# EAGLE design max232 (EAGLE 6.4)
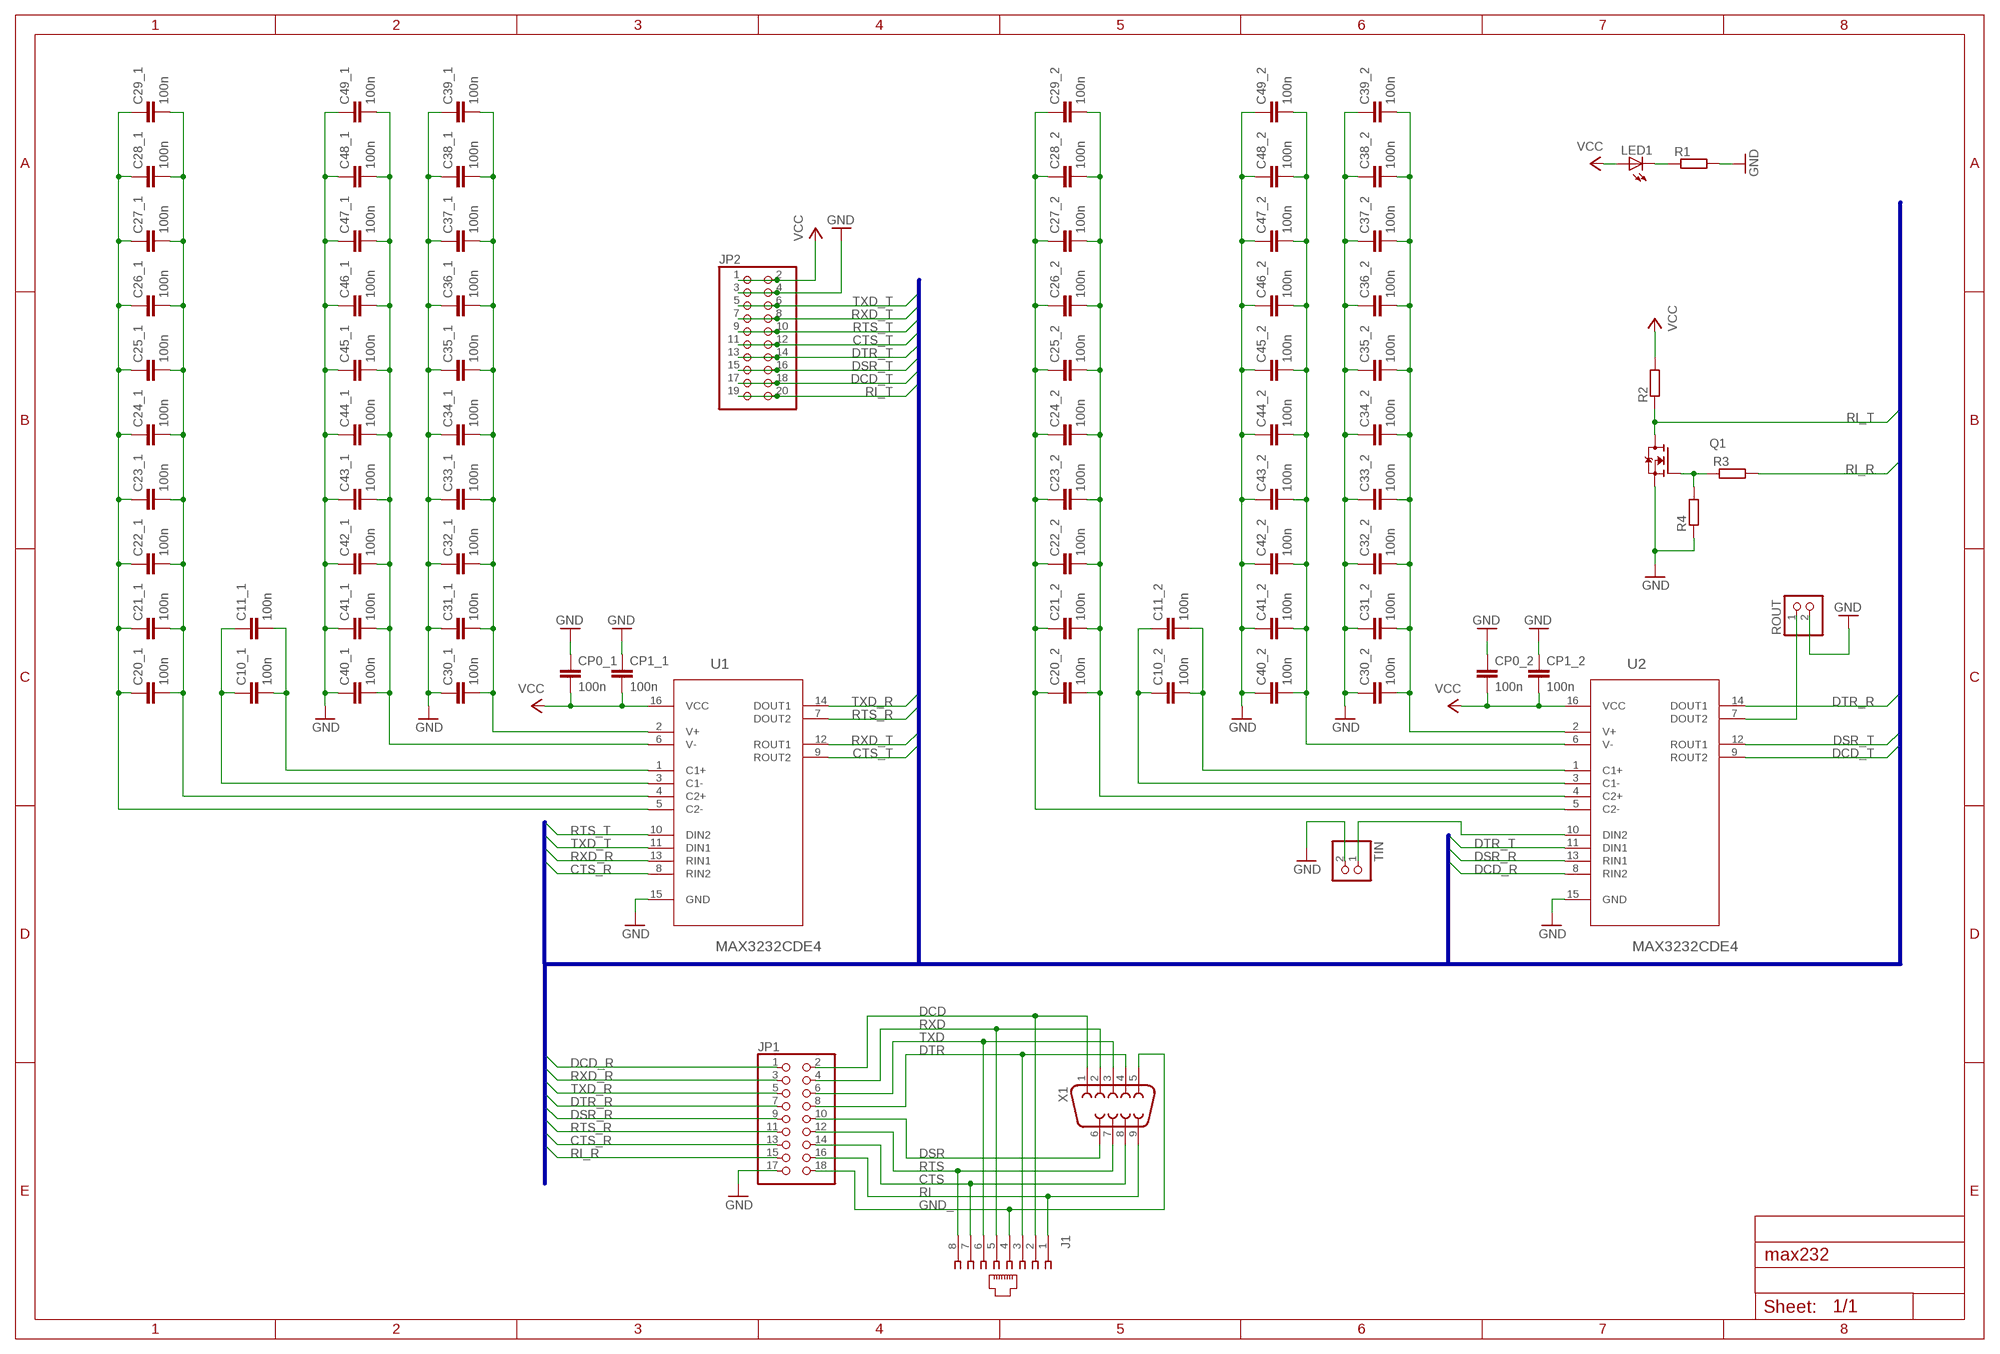
[diagram p0: schematic, sheet 1]

## Parts
C10_1  100n  C-EUC0402  [C0402]
C10_2  100n  C-EUC0402  [C0402]
C11_1  100n  C-EUC0402  [C0402]
C11_2  100n  C-EUC0402  [C0402]
C20_1  100n  C-EUC0402  [C0402]
C20_2  100n  C-EUC0402  [C0402]
C21_1  100n  C-EUC0402  [C0402]
C21_2  100n  C-EUC0402  [C0402]
C22_1  100n  C-EUC0402  [C0402]
C22_2  100n  C-EUC0402  [C0402]
C23_1  100n  C-EUC0402  [C0402]
C23_2  100n  C-EUC0402  [C0402]
C24_1  100n  C-EUC0402  [C0402]
C24_2  100n  C-EUC0402  [C0402]
C25_1  100n  C-EUC0402  [C0402]
C25_2  100n  C-EUC0402  [C0402]
C26_1  100n  C-EUC0402  [C0402]
C26_2  100n  C-EUC0402  [C0402]
C27_1  100n  C-EUC0402  [C0402]
C27_2  100n  C-EUC0402  [C0402]
C28_1  100n  C-EUC0402  [C0402]
C28_2  100n  C-EUC0402  [C0402]
C29_1  100n  C-EUC0402  [C0402]
C29_2  100n  C-EUC0402  [C0402]
C30_1  100n  C-EUC0402  [C0402]
C30_2  100n  C-EUC0402  [C0402]
C31_1  100n  C-EUC0402  [C0402]
C31_2  100n  C-EUC0402  [C0402]
C32_1  100n  C-EUC0402  [C0402]
C32_2  100n  C-EUC0402  [C0402]
C33_1  100n  C-EUC0402  [C0402]
C33_2  100n  C-EUC0402  [C0402]
C34_1  100n  C-EUC0402  [C0402]
C34_2  100n  C-EUC0402  [C0402]
C35_1  100n  C-EUC0402  [C0402]
C35_2  100n  C-EUC0402  [C0402]
C36_1  100n  C-EUC0402  [C0402]
C36_2  100n  C-EUC0402  [C0402]
C37_1  100n  C-EUC0402  [C0402]
C37_2  100n  C-EUC0402  [C0402]
C38_1  100n  C-EUC0402  [C0402]
C38_2  100n  C-EUC0402  [C0402]
C39_1  100n  C-EUC0402  [C0402]
C39_2  100n  C-EUC0402  [C0402]
C40_1  100n  C-EUC0402  [C0402]
C40_2  100n  C-EUC0402  [C0402]
C41_1  100n  C-EUC0402  [C0402]
C41_2  100n  C-EUC0402  [C0402]
C42_1  100n  C-EUC0402  [C0402]
C42_2  100n  C-EUC0402  [C0402]
C43_1  100n  C-EUC0402  [C0402]
C43_2  100n  C-EUC0402  [C0402]
C44_1  100n  C-EUC0402  [C0402]
C44_2  100n  C-EUC0402  [C0402]
C45_1  100n  C-EUC0402  [C0402]
C45_2  100n  C-EUC0402  [C0402]
C46_1  100n  C-EUC0402  [C0402]
C46_2  100n  C-EUC0402  [C0402]
C47_1  100n  C-EUC0402  [C0402]
C47_2  100n  C-EUC0402  [C0402]
C48_1  100n  C-EUC0402  [C0402]
C48_2  100n  C-EUC0402  [C0402]
C49_1  100n  C-EUC0402  [C0402]
C49_2  100n  C-EUC0402  [C0402]
CP0_1  100n  C-EUC0402  [C0402]
CP0_2  100n  C-EUC0402  [C0402]
CP1_1  100n  C-EUC0402  [C0402]
CP1_2  100n  C-EUC0402  [C0402]
J1  215877-4  [215877-4]
JP1  PINHD-2X9  [2X09]
JP2  PINHD-2X10/90  [2X10/90]
LED1  LEDCHIP-LED0603  [CHIP-LED0603]
Q1  N-MOSFET-SOT23-GSD  [SOT23]
R1  R-EU_R0603  [R0603]
R2  R-EU_R0603  [R0603]
R3  R-EU_R0603  [R0603]
R4  R-EU_R0603  [R0603]
ROUT  PINHD-1X2  [1X02]
TIN  PINHD-1X2  [1X02]
U1  MAX3232CDE4  [SOIC127P600X175-16N]
U2  MAX3232CDE4  [SOIC127P600X175-16N]
X1  F09HP  [F09HP]

## Nets
C1+1: C10_1.2 C11_1.2 U1.1(C1+)
C1+2: C10_2.2 C11_2.2 U2.1(C1+)
C1-1: C10_1.1 C11_1.1 U1.3(C1-)
C1-2: C10_2.1 C11_2.1 U2.3(C1-)
C2+1: C20_1.2 C21_1.2 C22_1.2 C23_1.2 C24_1.2 C25_1.2 C26_1.2 C27_1.2 C28_1.2 C29_1.2 U1.4(C2+)
C2+2: C20_2.2 C21_2.2 C22_2.2 C23_2.2 C24_2.2 C25_2.2 C26_2.2 C27_2.2 C28_2.2 C29_2.2 U2.4(C2+)
C2-1: C20_1.1 C21_1.1 C22_1.1 C23_1.1 C24_1.1 C25_1.1 C26_1.1 C27_1.1 C28_1.1 C29_1.1 U1.5(C2-)
C2-2: C20_2.1 C21_2.1 C22_2.1 C23_2.1 C24_2.1 C25_2.1 C26_2.1 C27_2.1 C28_2.1 C29_2.1 U2.5(C2-)
CTS: J1.7 JP1.14 X1.8
CTS_R: JP1.13 U1.8(RIN2)
CTS_T: JP2.11 JP2.12 U1.9(ROUT2)
DCD: J1.2 JP1.2 X1.1
DCD_R: JP1.1 U2.8(RIN2)
DCD_T: JP2.17 JP2.18 U2.9(ROUT2)
DSR: JP1.10 X1.6
DSR_R: JP1.9 U2.13(RIN1)
DSR_T: JP2.15 JP2.16 U2.12(ROUT1)
DTR: J1.3 JP1.8 X1.4
DTR_R: JP1.7 U2.14(DOUT1)
DTR_T: JP2.13 JP2.14 U2.11(DIN1)
GND: C30_1.1 C30_2.1 C31_1.1 C31_2.1 C32_1.1 C32_2.1 C33_1.1 C33_2.1 C34_1.1 C34_2.1 C35_1.1 C35_2.1 C36_1.1 C36_2.1 C37_1.1 C37_2.1 C38_1.1 C38_2.1 C39_1.1 C39_2.1 C40_1.1 C40_2.1 C41_1.1 C41_2.1 C42_1.1 C42_2.1 C43_1.1 C43_2.1 C44_1.1 C44_2.1 C45_1.1 C45_2.1 C46_1.1 C46_2.1 C47_1.1 C47_2.1 C48_1.1 C48_2.1 C49_1.1 C49_2.1 CP0_1.1 CP0_2.1 CP1_1.1 CP1_2.1 JP1.17 JP2.3 JP2.4 Q1.2(S) R1.2 R4.1 ROUT.2 TIN.2 U1.15(GND) U2.15(GND)
GND_: J1.4 JP1.18 X1.5
PWR_LED: LED1.C R1.1
RI: J1.1 JP1.16 X1.9
RI_G: Q1.1(G) R3.1 R4.2
RI_R: JP1.15 R3.2
RI_T: JP2.19 JP2.20 Q1.3(D) R2.1
ROUT: ROUT.1 U2.7(DOUT2)
RTS: J1.8 JP1.12 X1.7
RTS_R: JP1.11 U1.7(DOUT2)
RTS_T: JP2.9 JP2.10 U1.10(DIN2)
RXD: J1.5 JP1.4 X1.2
RXD_R: JP1.3 U1.13(RIN1)
RXD_T: JP2.7 JP2.8 U1.12(ROUT1)
TIN: TIN.1 U2.10(DIN2)
TXD: J1.6 JP1.6 X1.3
TXD_R: JP1.5 U1.14(DOUT1)
TXD_T: JP2.5 JP2.6 U1.11(DIN1)
V+1: C30_1.2 C31_1.2 C32_1.2 C33_1.2 C34_1.2 C35_1.2 C36_1.2 C37_1.2 C38_1.2 C39_1.2 U1.2(V+)
V+2: C30_2.2 C31_2.2 C32_2.2 C33_2.2 C34_2.2 C35_2.2 C36_2.2 C37_2.2 C38_2.2 C39_2.2 U2.2(V+)
V-1: C40_1.2 C41_1.2 C42_1.2 C43_1.2 C44_1.2 C45_1.2 C46_1.2 C47_1.2 C48_1.2 C49_1.2 U1.6(V-)
V-2: C40_2.2 C41_2.2 C42_2.2 C43_2.2 C44_2.2 C45_2.2 C46_2.2 C47_2.2 C48_2.2 C49_2.2 U2.6(V-)
VCC: CP0_1.2 CP0_2.2 CP1_1.2 CP1_2.2 JP2.1 JP2.2 LED1.A R2.2 U1.16(VCC) U2.16(VCC)

## Buses
DCD_T,DCD_R,RXD_T,RXD_R,TXD_T,TXD_R,DTR_T,DTR_R,DSR_T,DSR_R,RTS_T,RTS_R,CTS_T,CTS_R,RI_T,RI_R

## Library data of the parts
C10_1 C10_2 C11_1 C11_2 C20_1 C20_2 C21_1 C21_2 C22_1 C22_2 C23_1 C23_2 C24_1 C24_2 C25_1 C25_2 C26_1 C26_2 C27_1 C27_2 C28_1 C28_2 C29_1 C29_2 C30_1 C30_2 C31_1 C31_2 C32_1 C32_2 C33_1 C33_2 C34_1 C34_2 C35_1 C35_2 C36_1 C36_2 C37_1 C37_2 C38_1 C38_2 C39_1 C39_2 C40_1 C40_2 C41_1 C41_2 C42_1 C42_2 C43_1 C43_2 C44_1 C44_2 C45_1 C45_2 C46_1 C46_2 C47_1 C47_2 C48_1 C48_2 C49_1 C49_2 CP0_1 CP0_2 CP1_1 CP1_2 = rcl_upravena:C-EU: CAPACITOR, European symbol
J1 = con-amp:215877-4: AMP connector
JP1 = pinhead:PINHD-2X9: PIN HEADER
JP2 = pinhead:PINHD-2X10: PIN HEADER
LED1 = led:LED: LED OSRAM: - CHIPLED LG R971, LG N971, LY N971, LG Q971, LY Q971, LO R971, LY R971 LH N974, LH R974 LS Q976, LO Q976, LY Q976 LO Q996 - Hyper CHIPLED LW Q18S LB Q993, LB Q99A, LB R99A - SideLED LS A670, LO A670, LY A670, LG A670, LP A670 LB A673, LV A673, LT A673, LW A673 LH A674 LY A675 LS A676, LA A676, LO A676, LY A676, LW A676 LS A679, LY A679, LG A679 - Hyper Micro SIDELED® LS Y876, LA Y876, LO Y876, LY Y876 LT Y87S - SmartLED LW L88C, LW L88S LB L89C, LB L89S, LG L890 LS L89K, LO L89K, LY L89K LS L896, LA L896, LO L896, LY L896 - TOPLED LS T670, LO T670, LY T670, LG T670, LP T670 LSG T670, LSP T670, LSY T670, LOP T670, LYG T670 LG T671, LOG T671, LSG T671 LB T673, LV T673, LT T673, LW T673 LH T674 LS T676, LA T676, LO T676, LY T676, LB T676, LH T676, LSB T676, LW T676 LB T67C, LV T67C, LT T67C, LS T67K, LO T67K, LY T67K, LW E67C LS E67B, LA E67B, LO E67B, LY E67B, LB E67C, LV E67C, LT E67C LW T67C LS T679, LY T679, LG T679 LS T770, LO T770, LY T770, LG T770, LP T770 LB T773, LV T773, LT T773, LW T773 LH T774 LS E675, LA E675, LY E675, LS T675 LS T776, LA T776, LO T776, LY T776, LB T776 LHGB T686 LT T68C, LB T68C - Hyper Mini TOPLED® LB M676 - Mini TOPLED Santana® LG M470 LS M47K, LO M47K, LY M47K Source: http://www.osram.convergy.de LUXEON: - LUMILED® LXK2-PW12-R00, LXK2-PW12-S00, LXK2-PW14-U00, LXK2-PW14-V00 LXK2-PM12-R00, LXK2-PM12-S00, LXK2-PM14-U00 LXK2-PE12-Q00, LXK2-PE12-R00, LXK2-PE12-S00, LXK2-PE14-T00, LXK2-PE14-U00 LXK2-PB12-K00, LXK2-PB12-L00, LXK2-PB12-M00, LXK2-PB14-N00, LXK2-PB14-P00, LXK2-PB14-Q00 LXK2-PR12-L00, LXK2-PR12-M00, LXK2-PR14-Q00, LXK2-PR14-R00 LXK2-PD12-Q00, LXK2-PD12-R00, LXK2-PD12-S00 LXK2-PH12-R00, LXK2-PH12-S00 LXK2-PL12-P00, LXK2-PL12-Q00, LXK2-PL12-R00 Source: www.luxeon.com KINGBRIGHT: KA-3528ASYC Source: www.kingbright.com
Q1 = transistors:N-MOSFET
R1-R4 = rcl_upravena:R-EU_: RESISTOR, European symbol
ROUT TIN = pinhead:PINHD-1X2: PIN HEADER
U1 U2 = max3232:MAX3232CDE4: RS-232 Line Driver/receiver; MPN: MAX3232CDE4; OC_FARNELL: 1287437; OC_NEWARK: 26M0604; PACKAGE: SOIC-16; SUPPLIER: Texas Instrument
X1 = con-subd:F09: SUB-D; OC_FARNELL: unknown; OC_NEWARK: unknown

## Board
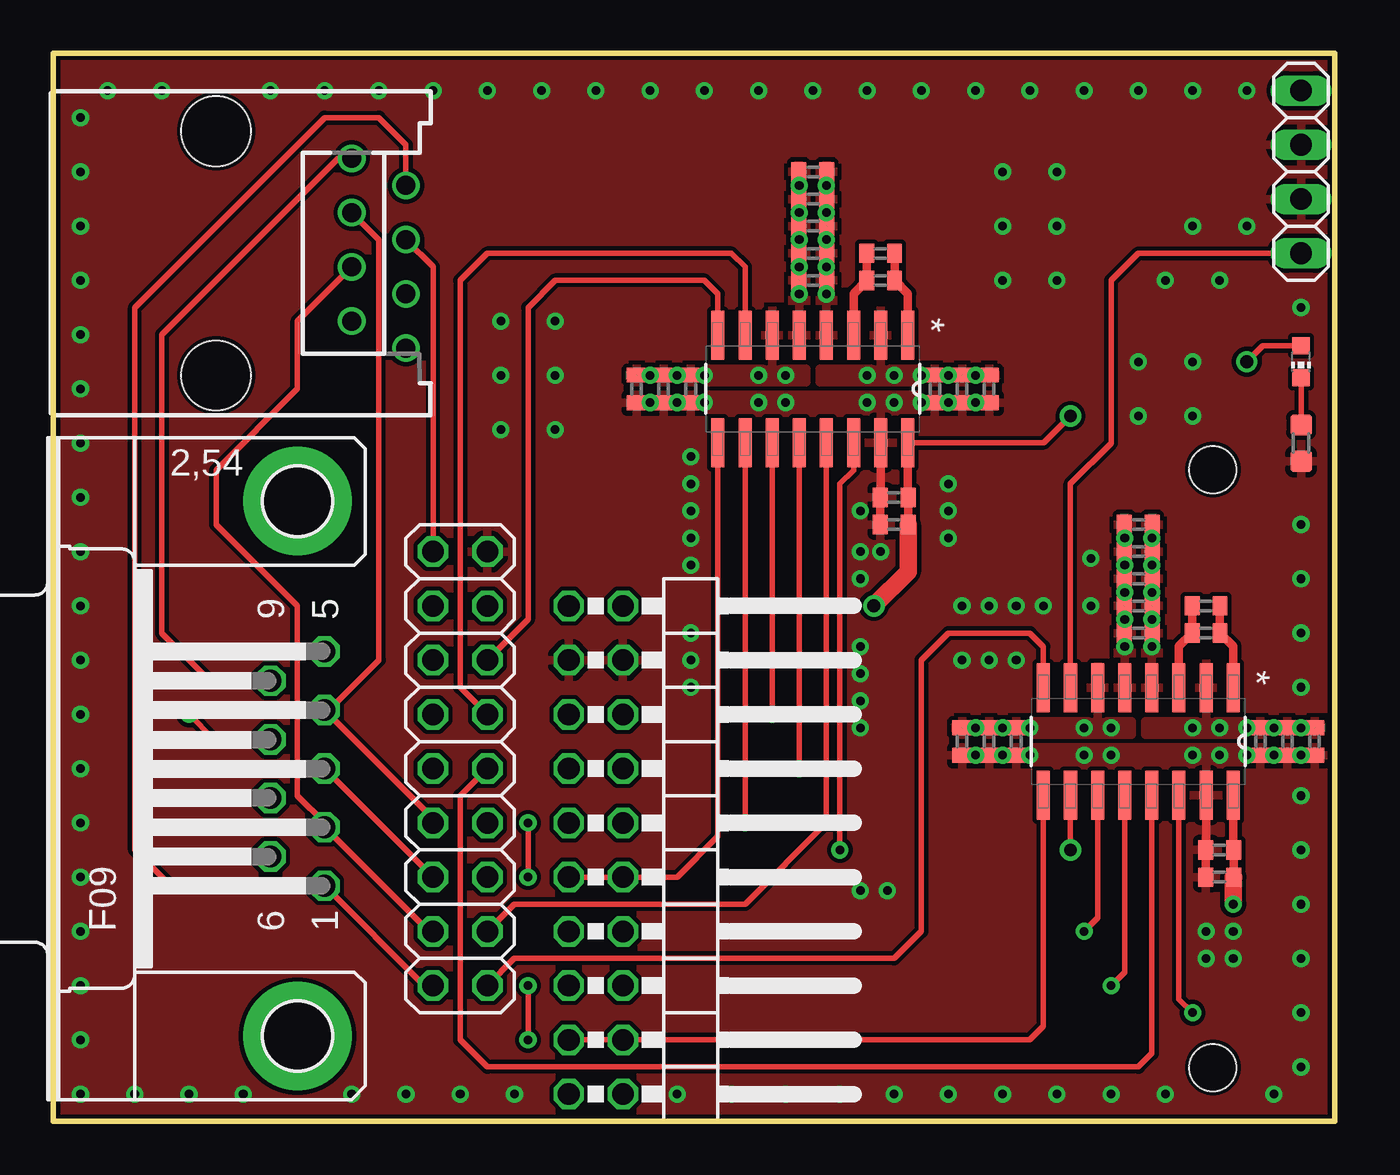
[diagram p1: board, top side]
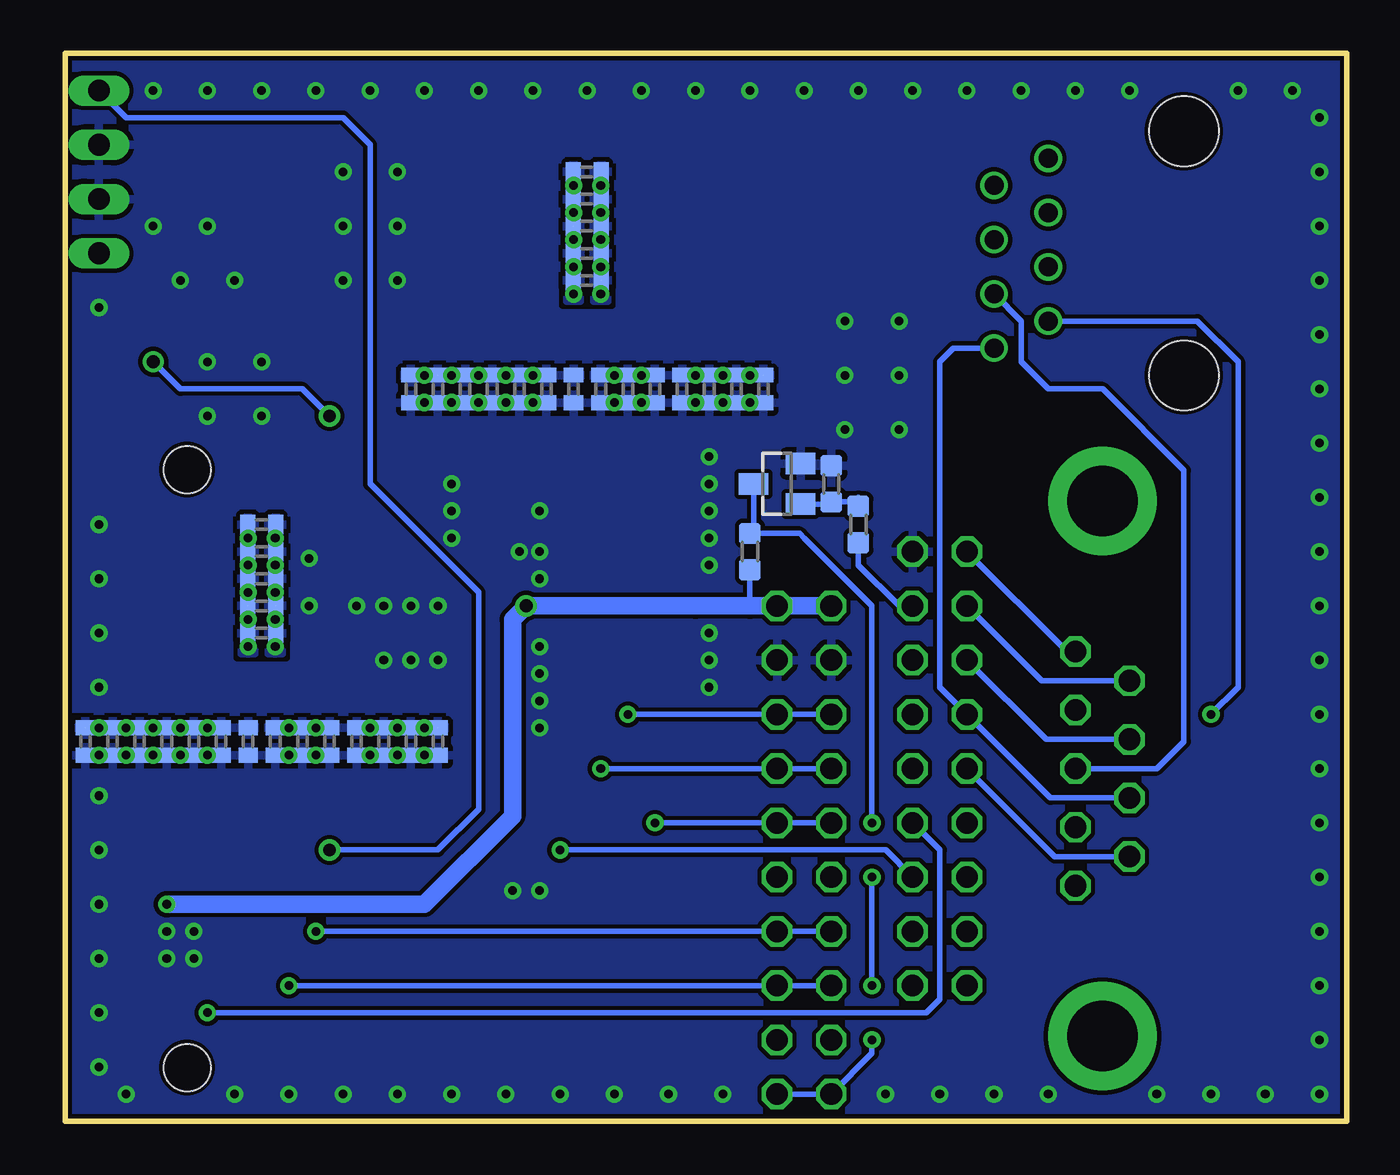
[diagram p2: board, bottom side, seen from below]

Size 60 x 50 mm. Coordinates in mm from the lower left corner, seen from the top.
Outline: 0,0 60,0 60,50 0,50 0,0
Copper layers (1*16): Top 0.035mm / dielectric 1.5mm / Bottom 0.035mm
Design rules "gatema_2layers": minimum track width 0.15mm, minimum drill 0.4mm, track to track 0.2mm, track to pad 0.2mm, pad to pad 0.2mm, via to via 0.2mm, smd to smd 0mil, copper to edge 0.2mm, drill to drill 0.4mm, minimum pad ring 0.2mm, minimum via ring 0.2mm, stop-mask expansion 2mil, vias tented up to drill 0.4mm, thermal gap 10mil
Holes 2.2 mm at 54.29,2.51 54.29,30.51

### Footprints (pad centres in the part's own frame; a part is rotated, then mirrored left to right if it is on the bottom)
C0402 = smd 0.7 x 0.9: 1 -0.65,0; 2 0.65,0
215877-4 = drill 0.889: 1 -4.445,6.35; 2 -3.175,8.89; 3 -1.905,6.35; 4 -0.635,8.89; 5 0.635,6.35; 6 1.905,8.89; 7 3.175,6.35; 8 4.445,8.89 | hole 3.251: -5.715,0; 5.715,0
2X09 = drill 1.016 octagon: 1 -10.16,-1.27; 2 -10.16,1.27; 3 -7.62,-1.27; 4 -7.62,1.27; 5 -5.08,-1.27; 6 -5.08,1.27; 7 -2.54,-1.27; 8 -2.54,1.27; 9 0,-1.27; 10 0,1.27; 11 2.54,-1.27; 12 2.54,1.27; 13 5.08,-1.27; 14 5.08,1.27; 15 7.62,-1.27; 16 7.62,1.27; 17 10.16,-1.27; 18 10.16,1.27
2X10/90 = drill 1.016 octagon: 1 -11.43,-6.35; 2 -11.43,-3.81; 3 -8.89,-6.35; 4 -8.89,-3.81; 5 -6.35,-6.35; 6 -6.35,-3.81; 7 -3.81,-6.35; 8 -3.81,-3.81; 9 -1.27,-6.35; 10 -1.27,-3.81; 11 1.27,-6.35; 12 1.27,-3.81; 13 3.81,-6.35; 14 3.81,-3.81; 15 6.35,-6.35; 16 6.35,-3.81; 17 8.89,-6.35; 18 8.89,-3.81; 19 11.43,-6.35; 20 11.43,-3.81
CHIP-LED0603 = smd 0.8 x 0.8: A 0,-0.75; C 0,0.75
SOT23 = smd 1 x 1.4: 1 -0.95,-1.1; 2 0.95,-1.1; 3 0,1.1
R0603 = smd 1 x 1: 1 -0.85,0; 2 0.85,0
1X02 = drill 1.016 long: 1 -1.27,0; 2 1.27,0
SOIC127P600X175-16N = smd 2.286 x 0.61: 1 -2.515,4.445; 2 -2.515,3.175; 3 -2.515,1.905; 4 -2.515,0.635; 5 -2.515,-0.635; 6 -2.515,-1.905; 7 -2.515,-3.175; 8 -2.515,-4.445; 9 2.515,-4.445; 10 2.515,-3.175; 11 2.515,-1.905; 12 2.515,-0.635; 13 2.515,0.635; 14 2.515,1.905; 15 2.515,3.175; 16 2.515,4.445
F09HP = drill 1.016 octagon: 1 -5.486,-1.27; 2 -2.743,-1.27; 3 0,-1.27; 4 2.743,-1.27; 5 5.486,-1.27; 6 -4.115,1.27; 7 -1.372,1.27; 8 1.372,1.27; 9 4.115,1.27 | drill 3.302 pad 5.08: G1 -12.522,0; G2 12.522,0

### Placement (x,y rotation side)
C10_1  38.73,39.37 0 top
C10_2  53.98,22.86 0 top
C11_1  38.73,40.64 0 top
C11_2  53.98,24.13 0 top
C20_1  35.56,39.37 0 top
C20_2  50.8,22.86 0 top
C21_1  35.56,40.64 0 top
C21_2  50.8,24.13 0 top
C22_1  35.56,41.91 0 top
C22_2  50.8,25.4 0 top
C23_1  35.56,43.18 0 top
C23_2  50.8,26.67 0 top
C24_1  35.56,44.45 0 top
C24_2  50.8,27.94 0 top
C25_1  35.56,44.45 180 bottom
C25_2  50.8,27.94 180 bottom
C26_1  35.56,43.18 180 bottom
C26_2  50.8,26.67 180 bottom
C27_1  35.56,41.91 180 bottom
C27_2  50.8,25.4 180 bottom
C28_1  35.56,40.64 180 bottom
C28_2  50.8,24.13 180 bottom
C29_1  35.56,39.37 180 bottom
C29_2  50.8,22.86 180 bottom
C30_1  43.81,34.29 90 top
C30_2  56.52,17.78 90 top
C31_1  42.55,34.29 90 top
C31_2  57.78,17.78 90 top
C32_1  41.27,34.29 90 top
C32_2  59.05,17.78 90 top
C33_1  43.81,34.29 90 bottom
C33_2  59.05,17.78 90 bottom
C34_1  42.55,34.29 90 bottom
C34_2  57.78,17.78 90 bottom
C35_1  41.27,34.29 90 bottom
C35_2  56.52,17.78 90 bottom
C36_1  40.01,34.29 90 bottom
C36_2  55.24,17.78 90 bottom
C37_1  38.73,34.29 90 bottom
C37_2  53.98,17.78 90 bottom
C38_1  37.47,34.29 90 bottom
C38_2  52.7,17.78 90 bottom
C39_1  36.2,34.29 90 bottom
C39_2  51.44,17.78 90 bottom
C40_1  27.3,34.29 90 top
C40_2  45.09,17.78 90 top
C41_1  28.57,34.29 90 top
C41_2  43.81,17.78 90 top
C42_1  29.84,34.29 90 top
C42_2  42.55,17.78 90 top
C43_1  27.3,34.29 90 bottom
C43_2  42.55,17.78 90 bottom
C44_1  28.57,34.29 90 bottom
C44_2  43.81,17.78 90 bottom
C45_1  29.84,34.29 90 bottom
C45_2  45.09,17.78 90 bottom
C46_1  31.11,34.29 90 bottom
C46_2  46.35,17.78 90 bottom
C47_1  32.38,34.29 90 bottom
C47_2  47.62,17.78 90 bottom
C48_1  33.66,34.29 90 bottom
C48_2  48.9,17.78 90 bottom
C49_1  34.92,34.29 90 bottom
C49_2  50.16,17.78 90 bottom
CP0_1  39.37,29.21 0 top
CP0_2  54.61,12.7 0 top
CP1_1  39.37,27.94 0 top
CP1_2  54.61,11.43 0 top
J1  7.62,40.64 270 top
JP1  19.05,16.51 90 top
JP2  30.48,12.7 270 top
LED1  58.42,35.56 180 top
Q1  26.67,29.84 90 bottom
R1  58.42,31.75 270 top
R2  27.94,26.67 270 bottom
R3  22.86,27.94 270 bottom
R4  24.13,29.84 270 bottom
ROUT  58.42,41.91 90 top
TIN  58.42,46.99 270 top
U1  35.56,34.29 270 top
U2  50.8,17.78 270 top
X1  11.43,16.51 90 top

### Tracks (layer width: path | path; a pad name or v marks a point on that pad's centre or on a via)
C1+1
  Top 0.406: U1.1 40.01,38.75 C10_1.2 C11_1.2
C1+2
  Top 0.406: U2.1 55.24,22.24 C10_2.2 C11_2.2
C1-1
  Top 0.406: U1.3 37.47,38.75 C10_1.1 C11_1.1
C1-2
  Top 0.406: U2.3 52.7,22.24 C10_2.1 C11_2.1
C2+1  (via drill 0.4)  (1 unrouted)
  Top 0.254: v36.2,43.81 36.2,44.44 C24_1.2 | v36.2,42.55 36.2,41.92 C22_1.2 36.2,41.9 v36.2,41.27 | v36.2,40.01 36.2,39.38 C20_1.2
  other vias: 36.2,38.73
  pour Top: 35.88,35.88 35.88,44.77 36.51,44.77 36.51,35.88
  pour Bottom: 35.88,38.42 35.88,44.77 36.51,44.77 36.51,38.42
C2+2  (via drill 0.4)  (1 unrouted)
  Top 0.254: v51.44,27.3 51.44,26.68 C23_2.2 | v51.44,26.04 51.44,25.41 C22_2.2 | v51.44,24.77 51.44,24.14 C21_2.2 51.44,24.11 v51.44,23.5
  other vias: 51.44,22.23
  pour Bottom: 51.12,21.91 51.12,28.26 51.75,28.26 51.75,21.91
  pour Top: 51.12,28.26 51.12,19.37 51.75,19.37 51.75,28.26
C2-1  (via drill 0.4)  (1 unrouted)
  Top 0.254: v34.92,43.81 34.92,43.2 C26_1.1 | v34.92,42.55 34.92,41.92 C27_1.1 | v34.92,41.27 34.92,40.66 C28_1.1 | v34.92,40.01 34.92,39.38 C29_1.1
  other vias: 34.92,38.73
  pour Top: 34.61,35.88 34.61,44.77 35.24,44.77 35.24,35.88
  pour Bottom: 34.61,38.42 34.61,44.77 35.24,44.77 35.24,38.42
C2-2  (via drill 0.4)  (1 unrouted)
  Top 0.254: v50.16,27.3 50.16,26.68 C26_2.1 50.16,26.66 v50.16,26.04 | v50.16,24.77 50.16,24.14 C28_2.1 50.16,24.11 v50.16,23.5
  other vias: 50.16,22.23
  pour Bottom: 49.85,21.91 49.85,28.26 50.48,28.26 50.48,21.91
  pour Top: 49.85,28.26 49.85,19.37 50.48,19.37 50.48,28.26
CTS  (via drill 0.4)
  Top 0.254: v6.35,19.05 7.52,17.88 X1.8
  Bottom 0.254: X1.8 14.07,17.88 JP1.14 | J1.7 6.99,37.47 5.08,35.56 5.08,20.32 v6.35,19.05
CTS_R
  Top 0.254: U1.8 31.11,38.73 30.48,39.37 23.5,39.37 22.23,38.1 22.23,23.5 JP1.13
CTS_T
  Top 0.254: U1.9 31.11,13.34 29.21,11.43 JP2.12 JP2.11
DCD
  Top 0.254: JP1.2 17.37,6.35 X1.1 5.49,11.02 3.81,12.7 3.81,38.1 12.7,46.99 15.24,46.99 16.51,45.72 J1.2
DCD_R
  Top 0.254: U2.8 46.35,22.23 45.72,22.86 41.91,22.86 40.64,21.59 40.64,8.89 39.37,7.62 21.59,7.62 JP1.1
DCD_T
  Top 0.254: U2.9 46.35,4.45 45.72,3.81 JP2.18 JP2.17
DSR
  Bottom 0.254: X1.6 13.66,12.39 JP1.10
DSR_R
  Top 0.254: U2.13 51.44,3.17 50.8,2.54 20.32,2.54 19.05,3.81 19.05,15.24 JP1.9
DSR_T  (via drill 0.4)
  Top 0.254: U2.12 50.16,6.99 v49.53,6.35
  Bottom 0.254: v49.53,6.35 JP2.16 JP2.15
DTR
  Top 0.254: JP1.8 17.78,14.17 X1.4 12.9,19.25 15.24,21.59 15.24,41.27 J1.3
DTR_R  (via drill 0.4)
  Top 0.254: U2.14 52.7,5.71 v53.34,5.08
  Bottom 0.254: v53.34,5.08 19.68,5.08 19.05,5.71 19.05,12.7 JP1.7
DTR_T  (via drill 0.4)
  Top 0.254: U2.11 48.9,9.53 v48.26,8.89
  Bottom 0.254: v48.26,8.89 JP2.14 JP2.13
GND  (via drill 0.4)
  Top 0.254: v43.18,17.14 42.56,17.14 C43_2.1 | v44.45,17.14 45.07,17.14 C45_2.1 | v57.15,17.14 56.53,17.14 C35_2.1 | C34_2.1 58.41,17.13 v58.42,17.14 | C43_1.1 27.93,33.64 v27.94,33.66 | v29.21,33.66 v30.48,33.66 | C34_1.1 43.16,33.64 v43.18,33.66 | C35_1.1 41.9,33.64 v41.91,33.66
  Top 0.406: U1.15 38.73,29.23 CP0_1.1 CP1_1.1 | U2.15 53.98,12.71 CP0_2.1 CP1_2.1
  other vias: 38.1,33.66 39.37,33.66 40.64,33.66 45.72,17.14 53.34,17.14 54.61,17.14 55.88,17.14 49.53,17.14 48.26,17.14 34.29,33.66 33.02,33.66 1.27,1.27 1.27,3.81 1.27,6.35 1.27,8.89 1.27,11.43 1.27,13.97 1.27,16.51 1.27,19.05 1.27,21.59 1.27,24.13 1.27,26.67 1.27,29.21 1.27,31.75 1.27,34.29 1.27,36.83 1.27,39.37 1.27,41.91 1.27,44.45 1.27,46.99 2.54,48.26 5.08,48.26 10.16,48.26 12.7,48.26 15.24,48.26 17.78,48.26 20.32,48.26 22.86,48.26 25.4,48.26 27.94,48.26 30.48,48.26 33.02,48.26 35.56,48.26 38.1,48.26 40.64,48.26 43.18,48.26 45.72,48.26 48.26,48.26 50.8,48.26 53.34,48.26 55.88,48.26 3.81,1.27 6.35,1.27 8.89,1.27 13.97,1.27 16.51,1.27 19.05,1.27 21.59,1.27 29.21,1.27 31.75,1.27 34.29,1.27 36.83,1.27 39.37,1.27 41.91,1.27 44.45,1.27 46.99,1.27 49.53,1.27 52.07,1.27 57.15,1.27 58.42,2.54 58.42,5.08 58.42,7.62 58.42,10.16 58.42,12.7 58.42,15.24 58.42,20.32 58.42,22.86 58.42,25.4 58.42,27.94 58.42,38.1 37.78,26.67 38.73,26.67 53.98,8.89 53.98,7.62 55.24,8.89 55.24,7.62 37.78,22.23 37.78,20.95 37.78,19.68 37.78,18.41 20.95,32.38 20.95,34.92 20.95,37.47 23.5,37.47 23.5,34.92 23.5,32.38 29.84,26.04 29.84,28.57 29.84,31.11 29.84,29.84 29.84,27.3 29.84,22.86 29.84,21.59 29.84,20.32 42.55,24.13 43.81,24.13 45.09,24.13 46.35,24.13 41.91,27.3 41.91,28.57 41.91,29.84 42.55,21.59 43.81,21.59 45.09,21.59 39.05,10.79 37.78,10.79 55.88,41.91 53.34,41.91 54.61,39.37 52.07,39.37 53.34,35.56 50.8,35.56 53.34,33.02 50.8,33.02 48.58,24.13 48.58,26.35 37.78,28.57 37.78,25.4 44.45,44.45 44.45,41.91 44.45,39.37 46.99,44.45 46.99,41.91 46.99,39.37
  pour Top (rank 2): 0,0 0,50 60,50 60,0
  pour Bottom (rank 2): 0,0 0,50 60,50 60,0
GND_
  Top 0.254: JP1.18 17.78,40.01 J1.4
  Bottom 0.254: X1.5 13.11,22 JP1.18
PWR_LED
  Top 0.254: LED1.C R1.1
RI
  Top 0.254: J1.1 13.34,45.09 5.08,36.83 5.08,22.86 6.35,21.59 7.32,20.62 X1.9
  Bottom 0.254: X1.9 14.28,20.62 JP1.16
RI_G
  Bottom 0.254: 22.86,29.21 R3.1 23.07,29 R4.2 24.23,28.89 Q1.1
RI_R
  Bottom 0.254: JP1.15 20.95,24.13 22.86,26.04 R3.2
RI_T  (via drill 0.4)
  Top 0.254: v22.23,13.97 v22.23,11.43 | v22.23,6.35 v22.23,3.81
  Bottom 0.254: v22.23,13.97 22.23,24.13 23.5,25.4 25.4,27.3 25.61,27.52 R2.1 27.77,27.69 Q1.3 | v22.23,11.43 v22.23,6.35 | v22.23,3.81 22.23,3.17 JP2.19 JP2.20
ROUT
  Top 0.254: U2.7 47.62,29.84 49.53,31.75 49.53,39.37 50.8,40.64 ROUT.1
RTS
  Bottom 0.254: X1.7 13.87,15.14 JP1.12 19.05,20.32 19.05,35.56 18.41,36.2 J1.8
RTS_R
  Top 0.254: U1.7 32.38,40.01 31.75,40.64 20.32,40.64 19.05,39.37 19.05,20.32 JP1.11
RTS_T  (via drill 0.4)
  Top 0.254: U1.10 32.38,14.61 v32.38,13.97
  Bottom 0.254: v32.38,13.97 JP2.10 JP2.9
RXD
  Top 0.254: JP1.4 17.58,8.89 X1.2 12.7,13.97 11.43,15.24 11.43,24.13 10.16,25.4 7.62,27.94 7.62,30.48 11.43,34.29 11.43,37.47 J1.5
RXD_R
  Top 0.254: U1.13 36.2,17.14 36.2,15.88 36.2,13.97 32.38,10.16 21.59,10.16 JP1.3
RXD_T  (via drill 0.4)
  Top 0.254: U1.12 34.92,19.68 34.92,19.05 v34.92,16.51
  Bottom 0.254: v34.92,16.51 JP2.8 JP2.7
TIN  (via drill 0.6)
  Top 0.254: U2.10 v47.62,12.7
  Bottom 0.254: v47.62,12.7 42.55,12.7 40.64,14.61 40.64,24.77 45.72,29.84 45.72,45.72 46.99,46.99 57.15,46.99 TIN.1
TXD
  Top 0.254: JP1.6 X1.3
  Bottom 0.254: X1.3 8.89,16.51 7.62,17.78 7.62,30.48 11.43,34.29 13.97,34.29 15.24,35.56 15.24,37.47 J1.6
TXD_R  (via drill 0.4)
  Top 0.254: U1.14 37.47,30.48 36.83,29.84 36.83,17.78 36.83,17.14 v36.83,12.7
  Bottom 0.254: v36.83,12.7 21.59,12.7 JP1.5
TXD_T  (via drill 0.4)
  Top 0.254: U1.11 33.66,19.68 v33.66,19.05
  Bottom 0.254: v33.66,19.05 JP2.6 JP2.5
V+1  (via drill 0.4)  (1 unrouted)
  Top 0.254: v41.91,34.92 v43.18,34.92 43.16,34.94 C31_1.2
  other vias: 38.1,34.92 39.37,34.92 40.64,34.92
  pour Bottom: 35.88,35.24 35.88,34.61 44.13,34.61 44.13,35.24
  pour Top: 44.13,35.24 44.13,34.61 35.88,34.61 35.88,35.24 38.42,35.24 38.42,37.94 39.05,37.94 39.05,35.24
V+2  (via drill 0.4)  (1 unrouted)
  Top 0.254: v57.15,18.41 v58.42,18.41 59.04,18.41 C32_2.2
  other vias: 53.34,18.41 54.61,18.41 55.88,18.41
  pour Top: 59.37,18.73 59.37,18.1 51.12,18.1 51.12,18.73 53.66,18.73 53.66,21.43 54.29,21.43 54.29,18.73
  pour Bottom: 51.12,18.73 51.12,18.1 59.37,18.1 59.37,18.73
V-1  (via drill 0.4)  (1 unrouted)
  Top 0.254: C43_1.2 27.93,34.94 v27.94,34.92 | C41_1.2 29.2,34.94 v29.21,34.92
  other vias: 33.02,34.92 34.29,34.92 30.48,34.92
  pour Bottom: 26.99,35.24 26.99,34.61 35.24,34.61 35.24,35.24
  pour Top: 26.99,35.24 26.99,34.61 35.24,34.61 35.24,35.24 33.97,35.24 33.97,37.94 33.34,37.94 33.34,35.24
V-2  (via drill 0.4)  (1 unrouted)
  Top 0.254: v43.18,18.41 42.56,18.41 C42_2.2 | C41_2.2 44.44,18.43 v44.45,18.41
  other vias: 45.72,18.41 48.26,18.41 49.53,18.41
  pour Bottom: 42.23,18.73 42.23,18.1 50.48,18.1 50.48,18.73
  pour Top: 42.23,18.73 42.23,18.1 50.48,18.1 50.48,18.73 49.21,18.73 49.21,21.27 48.58,21.27 48.58,18.73
VCC  (via drill 0.4, 0.6)
  Top 0.254: v55.88,35.56 56.63,36.31 LED1.A | U1.16 46.38,31.77 v47.62,33.02
  Top 0.406: U1.16 40.01,29.23 CP0_1.2 CP1_1.2 | U2.16 55.24,12.71 CP0_2.2 CP1_2.2
  Top 0.813: CP1_1.2 40.02,25.73 v38.42,24.13 | v55.24,10.16 55.24,11.41 CP1_2.2
  Bottom 0.254: v47.62,33.02 48.9,34.29 54.61,34.29 v55.88,35.56 | R2.2 27.94,24.13
  Bottom 0.813: JP2.1 JP2.2 27.94,24.13 30.48,24.13 v38.42,24.13 39.05,23.5 39.05,14.29 43.18,10.16 v55.24,10.16

### Text on the board
Document: RS232 TTL adapter | TIN | GND | GND | v1.0 | ROUT | EIA-561